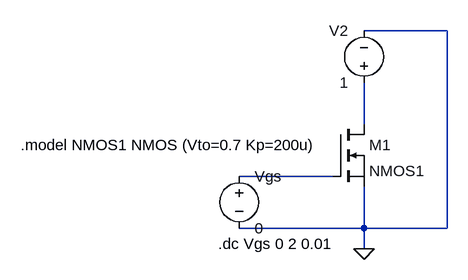
[diagram p0: schematic mos_transconductance.asc]
mos_transconductance.asc, the LTspice schematic file:
Version 4.1
SHEET 1 880 680
WIRE 176 -16 48 -16
WIRE 48 128 48 64
WIRE 0 208 -144 208
WIRE 48 288 48 224
WIRE 48 288 -144 288
WIRE 176 288 176 -16
WIRE 176 288 48 288
WIRE 48 320 48 288
FLAG 48 320 0
SYMBOL nmos 0 128 R0
SYMATTR InstName M1
SYMATTR Value NMOS1
SYMBOL voltage -144 192 R0
WINDOW 123 0 0 Left 0
WINDOW 39 0 0 Left 0
SYMATTR InstName Vgs
SYMATTR Value 0
SYMBOL voltage 48 80 R180
WINDOW 0 24 96 Left 2
WINDOW 3 24 16 Left 2
WINDOW 123 0 0 Left 0
WINDOW 39 0 0 Left 0
SYMATTR InstName V2
SYMATTR Value 1
TEXT -176 312 Left 2 !.dc Vgs 0 2 0.01
TEXT -480 160 Left 2 !.model NMOS1 NMOS (Vto=0.7 Kp=200u)

The netlist it stands for:
* mos_transconductance.asc
M1 N001 N002 0 0 NMOS1
Vgs N002 0 0
V2 N001 0 1
.model NMOS NMOS
.model PMOS PMOS
.lib standard.mos
.dc Vgs 0 2 0.01
.model NMOS1 NMOS (Vto=0.7 Kp=200u)
.backanno
.end